# EAGLE design rgb-nir-uv-breakout (EAGLE 6.5.0)
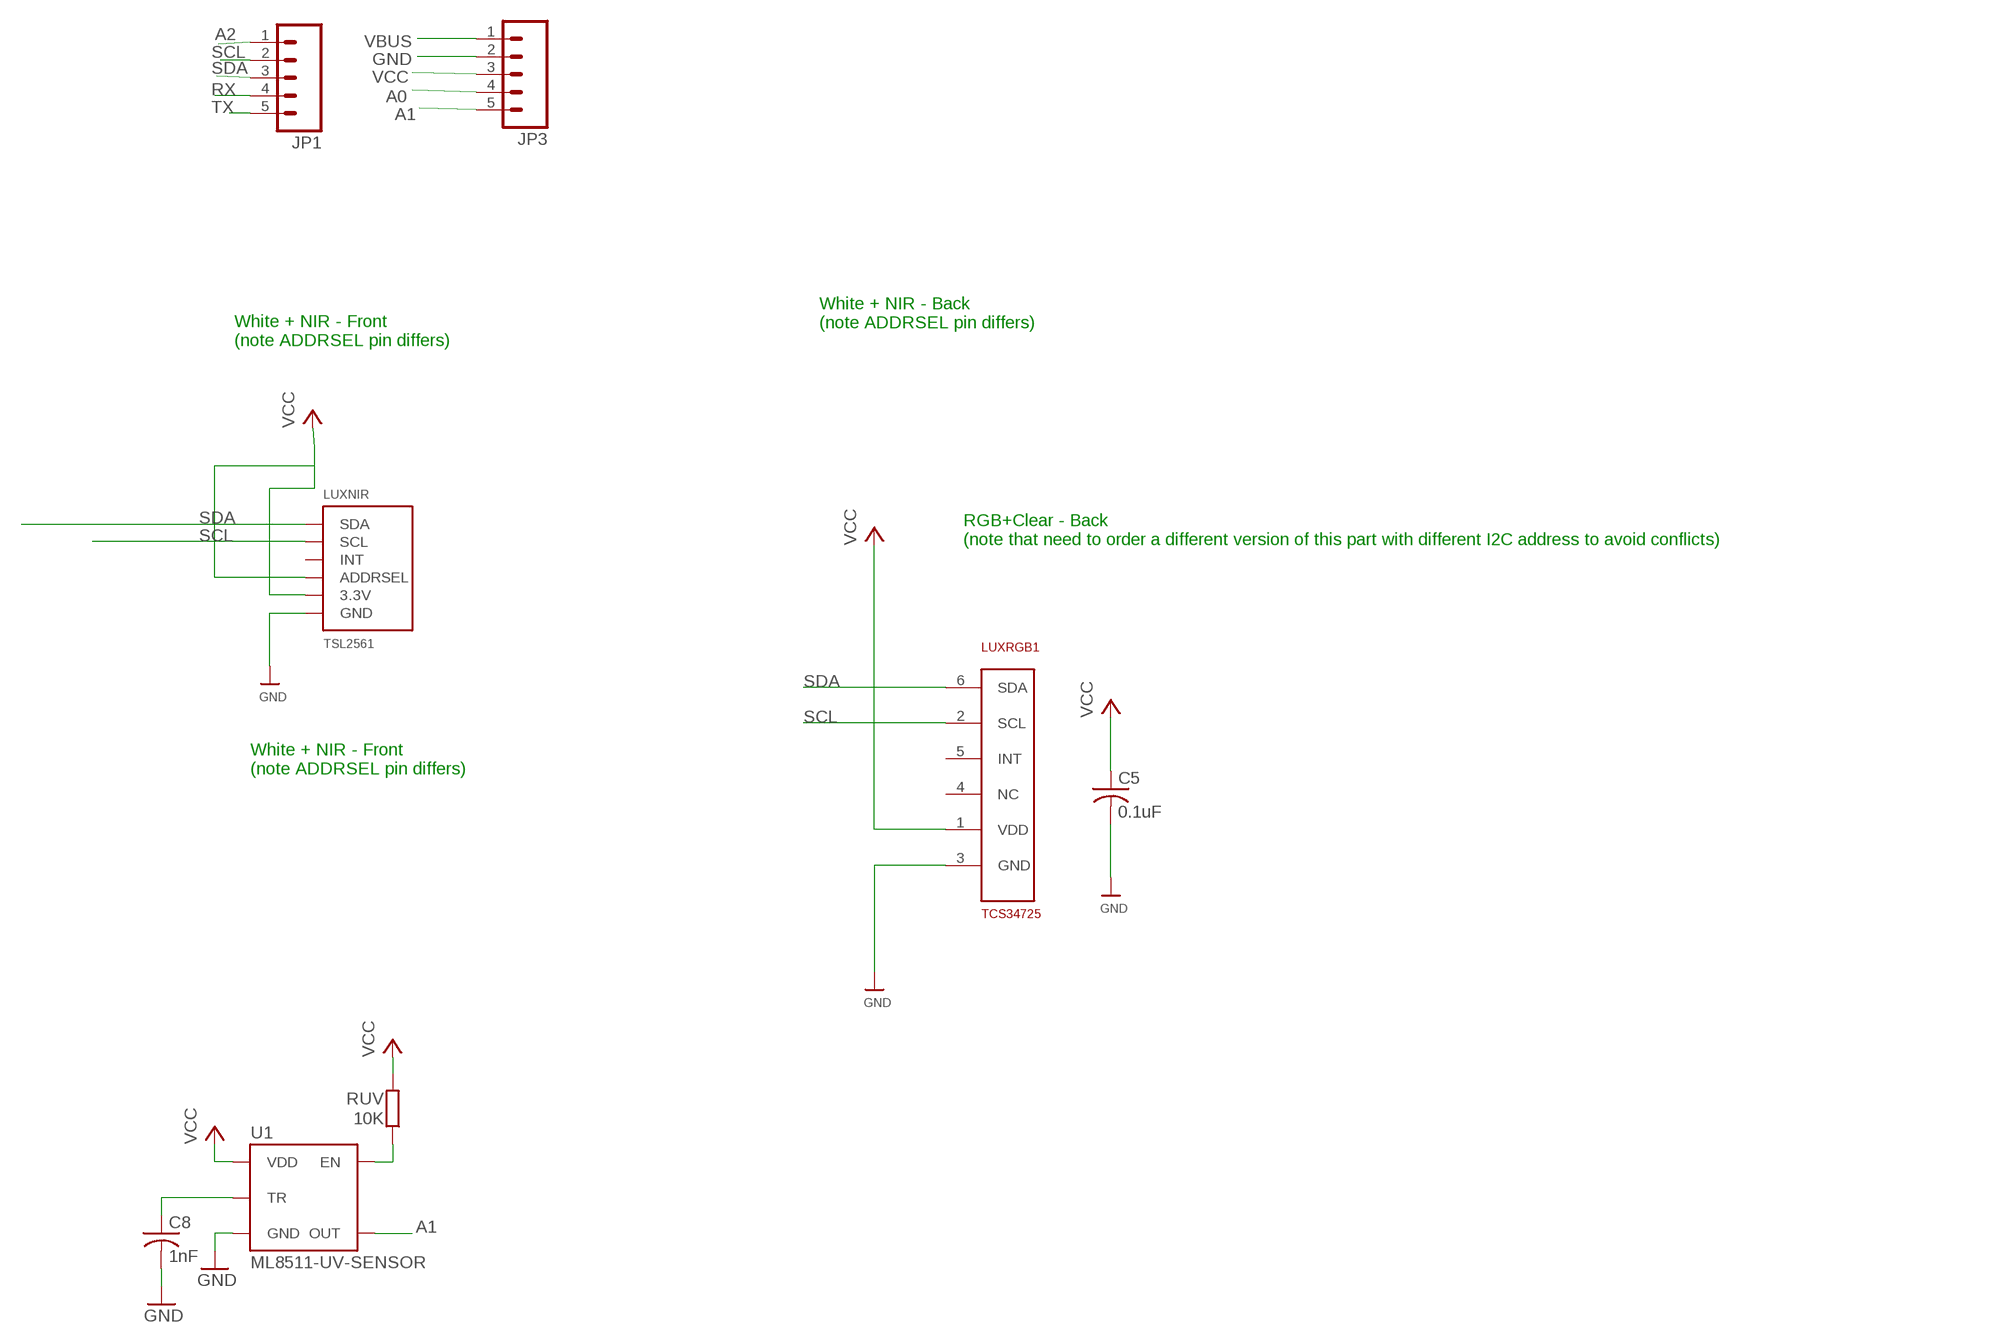
[diagram p0: schematic, sheet 1]

## Parts
C5  0.1uF  C-USC0805  [C0805]
C8  1nF  C-USC0805  [C0805]
JP1  M05LOCK  [1X05_LOCK]
JP3  M05LOCK  [1X05_LOCK]
LUXNIR  TSL2561  [TSL2561_FN@1]
LUXRGB1  TCS34725  [DFN-6]
RUV  10K  R-EU_R0805  [R0805]
U1  ML8511-UV-SENSOR  ML8511-UV-SENSORSMD  [ML8511]

## Nets
A0: JP3.4
A1: JP3.5 U1.8(OUT)
A2: JP1.1
ENABLE: RUV.1 U1.4(EN)
GND: C5.2 C8.2 JP3.2 LUXNIR.VSS(GND) LUXRGB1.3(GND) U1.5(GND)
N$8: C8.1 U1.10(TR)
RX: JP1.4
SCL: JP1.2 LUXNIR.CLK(SCL) LUXRGB1.2(SCL)
SDA: JP1.3 LUXNIR.DATA(SDA) LUXRGB1.6(SDA)
TX: JP1.5
VBUS: JP3.1
VCC: C5.1 JP3.3 LUXNIR.ADR(ADDRSEL) LUXNIR.VDD(3.3V) LUXRGB1.1(VDD) RUV.2 U1.7(VDD)
Unconnected: LUXNIR.INT LUXRGB1.4(NC) LUXRGB1.5(INT)

## Notes on the sheet
- White + NIR - Back
  (note ADDRSEL pin differs)
- White + NIR - Front
  (note ADDRSEL pin differs)
- RGB+Clear - Back 
  (note that need to order a different version of this part with different I2C address to avoid conflicts)
- White + NIR - Front
  (note ADDRSEL pin differs)

## Library data of the parts
C5 C8 = adafruit:C-US: CAPACITOR, American symbol
JP1 JP3 = SparkFun-Connectors:M05: Header 5 Standard 5-pin 0.1" header. Use with straight break away headers (SKU : PRT-00116), right angle break away headers (PRT-00553), swiss pins (PRT-00743), machine pins (PRT-00117), and female headers (PRT-00115). Molex polarized connector foot print use with SKU : PRT-08230 with associated crimp pins and housings.
LUXNIR = microbuilder:TSL2561: TSL2561 Light-To-Digital Sensor Mouser Part Numbers: CS (obsolete): 856-TSL2561CS DFN (cheapest): 856-TSL2561FN
LUXRGB1 = dwbLibrary:TCS34725
RUV = rcl:R-EU_: RESISTOR, European symbol
U1 = ML8511:ML8511-UV-SENSOR

## Board
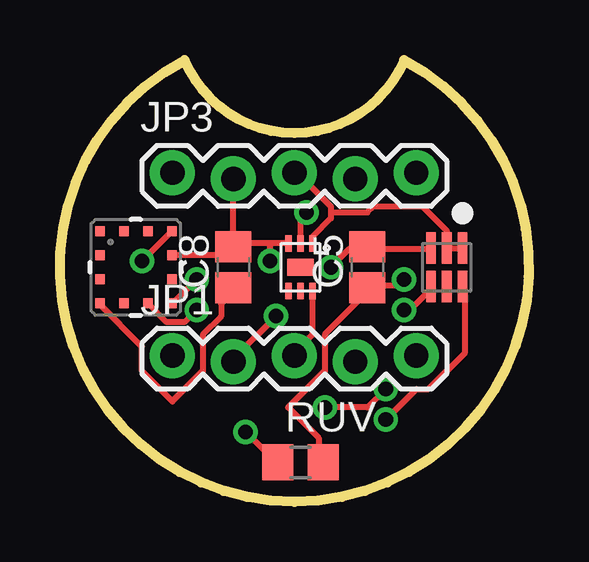
[diagram p1: board, top side]
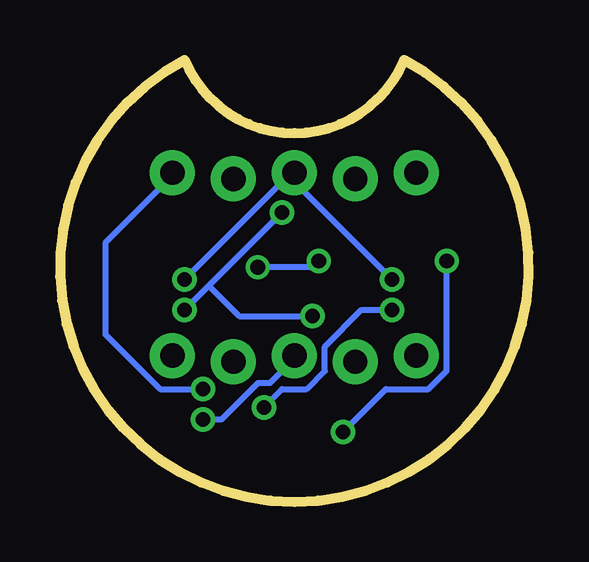
[diagram p2: board, bottom side, seen from below]

Size 19.53 x 18.41 mm. Coordinates in mm from the lower left corner, seen from the top.
Outline: 14.34,18.41 arc-135 5.19,18.41 arc304 14.34,18.41
Copper layers (1*16): Top 0.035mm / dielectric 1.5mm / Bottom 0.035mm
Design rules "default": minimum track width 10mil, minimum drill 24mil, track to track 8mil, track to pad 8mil, pad to pad 8mil, via to via 8mil, smd to smd 8mil, copper to edge 40mil, drill to drill 8mil, minimum pad ring 10mil, minimum via ring 8mil, stop-mask expansion 4mil, vias tented up to drill 0mil, thermal gap 10mil

### Footprints (pad centres in the part's own frame; a part is rotated, then mirrored left to right if it is on the bottom)
C0805 = smd 1.3 x 1.5: 1 -0.85,0; 2 0.85,0
1X05_LOCK = drill 1.016 pad 1.88: 1 0,0.127; 2 2.54,-0.127; 3 5.08,0.127; 4 7.62,-0.127; 5 10.16,0.127
TSL2561_FN@1 = smd 1.3 x 0.4: ADR -0.8,0; CLK 0.8,-0.65; DATA 0.8,0.65; INT 0.8,0; VDD -0.8,0.65; VSS -0.8,-0.65
DFN-6 = smd 0.28 x 0.7: 1 -0.5,-0.988; 2 0,-0.988; 3 0.5,-0.988; 4 0.5,0.988; 5 0,0.988; 6 -0.5,0.988 | smd 1.1 x 0.7: P$1 0,0
R0805 = smd 1.3 x 1.5: 1 -0.95,0; 2 0.95,0
ML8511 = smd 0.4 x 0.4: 1 -1.5,-1.5; 2 -1.5,-0.5; 3 -1.5,0.5; 4 -1.5,1.5; 5 -0.5,1.5; 6 0.5,1.5; 7 1.5,1.5; 8 1.5,0.5; 9 1.5,-0.5; 10 1.5,-1.5; 11 0.5,-1.5; 12 -0.5,-1.5

### Placement (x,y rotation side)
C5  12.81,9.77 90 top
C8  7.22,9.77 90 top
JP1  4.68,5.96 0 top
JP3  4.68,13.58 0 top
LUXNIR  16.11,9.77 270 top
LUXRGB1  10.02,9.77 180 top
RUV  10.02,1.64 0 top
U1  3.16,9.77 270 top

### Tracks (layer width: path | path; a pad name or v marks a point on that pad's centre or on a via)
A1  (via drill 0.61)
  Top 0.254: v5.7,7.99 5.19,7.49 4.43,7.49 3.67,8.25 U1.8 | v11.03,3.93 12.81,3.93 v13.57,4.69
  Bottom 0.254: v5.7,7.99 6.97,7.99 8.49,6.47 8.49,5.45 9.26,4.69 10.27,4.69 v11.03,3.93 | v13.57,4.69 15.35,4.69 17.64,6.98 17.64,10.79 14.84,13.58 JP3.5
ENABLE  (via drill 0.61)
  Top 0.254: v3.41,10.03 U1.4 4.68,11.3 | v7.73,2.91 9,1.64 RUV.1
  Bottom 0.254: v3.41,10.03 3.41,5.45 4.18,4.69 5.95,4.69 v7.73,2.91
GND  (via drill 0.61)
  Top 0.254: 12.81,10.53 15.35,10.53 LUXNIR.VSS | U1.5 4.68,10.28 6.97,10.28 7.22,10.53 C8.2 7.22,10.79 | 7.22,10.79 8.75,10.79 | 8.75,10.79 9.51,10.79 LUXRGB1.3 | 12.81,10.53 12.05,10.53 v11.29,9.77 | 8.75,10.79 v8.75,10.03 | 12.81,10.53 C5.2 | 7.22,10.79 JP3.2
  Bottom 0.254: v11.29,9.77 9,9.77 v8.75,10.03
N$8
  Top 0.254: U1.10 1.64,8.25 3.41,6.47 3.41,5.45 4.68,4.18 5.95,5.45 5.95,6.98 6.72,7.74 6.72,8.25 7.22,8.76 C8.1
SCL  (via drill 0.61)
  Top 0.254: LUXRGB1.2 10.02,11.8 v10.27,12.06 | v14.34,7.99 14.59,7.99 15.35,8.76 LUXNIR.CLK | v9,7.74 7.22,5.96 JP1.2
  Bottom 0.254: v14.34,7.99 13.32,9.01 | 13.32,9.01 v10.27,12.06 | v9,7.74 12.05,7.74 13.32,9.01
SDA  (via drill 0.61)
  Top 0.254: LUXRGB1.6 10.53,8.76 10.53,6.98 9.76,6.22 JP1.3 | v13.57,3.42 14.84,4.69 15.35,4.69 16.88,6.22 16.88,8.76 LUXNIR.DATA
  Bottom 0.254: v13.57,3.42 12.81,3.42 11.29,4.95 10.78,4.95 9.76,5.96 JP1.3
VCC  (via drill 0.61)
  Top 0.254: RUV.2 10.78,1.64 10.78,2.66 9.51,3.93 11.03,5.45 11.03,6.98 12.81,8.76 C5.1 12.81,9.01 14.08,9.01 v14.34,9.26 | LUXNIR.VDD 16.62,10.53 16.11,10.53 LUXNIR.ADR 16.11,11.3 15.1,12.31 13.07,12.31 12.81,12.06 11.29,12.06 | v5.7,9.26 4.68,8.25 U1.7 | 11.29,12.06 11.29,12.31 9.76,13.84 JP3.3 | 11.29,12.06 11.29,11.8 10.53,11.04 10.53,10.79 LUXRGB1.1
  Bottom 0.254: 10.02,13.58 v5.7,9.26 | 10.02,13.58 9.76,13.84 JP3.3 10.02,13.58 | 10.02,13.58 v14.34,9.26